# EAGLE schematic robo-tito2 (EAGLE 7.3.0)
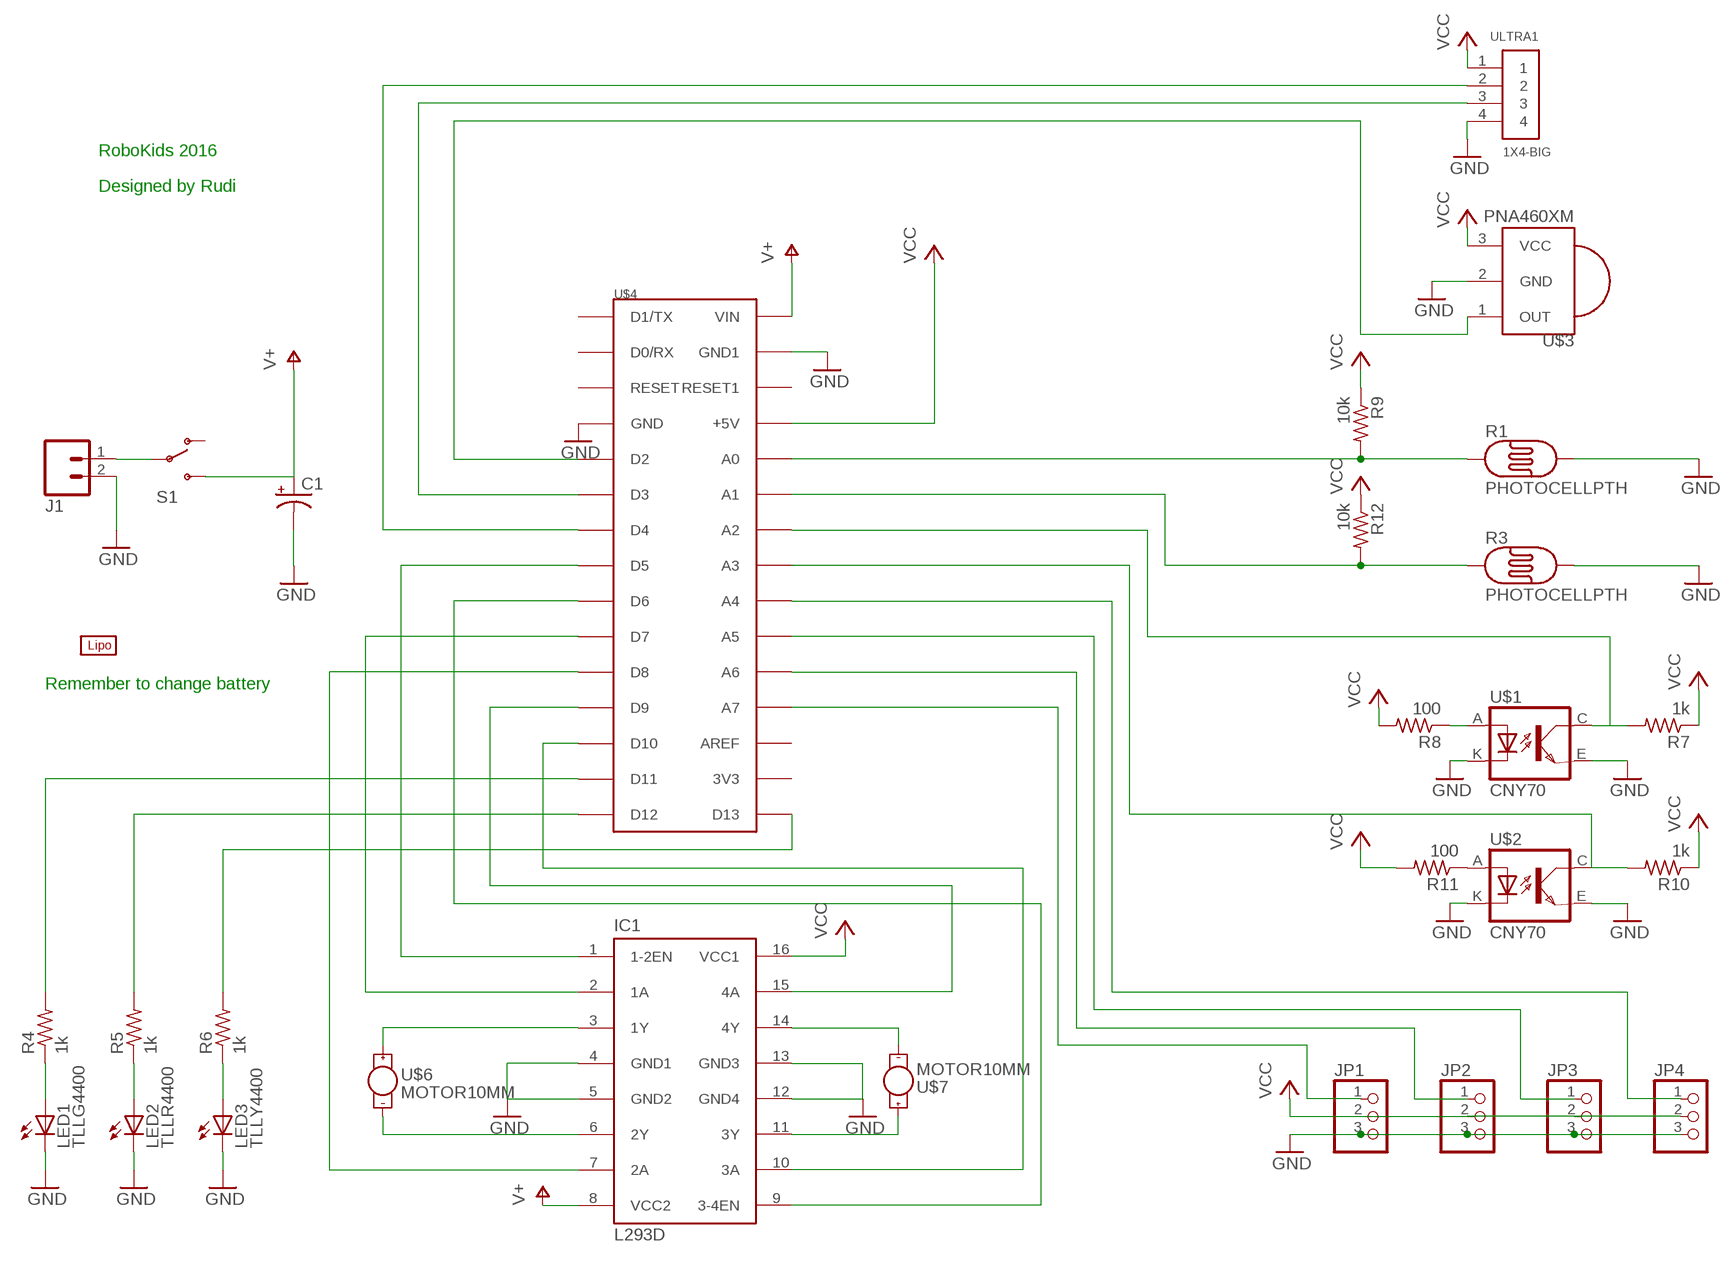
[diagram p0: schematic, sheet 1]

## Parts
C1  CPOL-USE10-20  [EB20D]
IC1  L293D  [DIL16]
J1  M02-JST-2-PTH-NO_SILK  [JST-2-PTH-NS]
JP1  PINHD-1X3  [1X03]
JP2  PINHD-1X3  [1X03]
JP3  PINHD-1X3  [1X03]
JP4  PINHD-1X3  [1X03]
LED1  TLLG4400  [LED3MM]
LED2  TLLR4400  [LED3MM]
LED3  TLLY4400  [LED3MM]
R1  PHOTOCELLPTH  [PHOTOCELL]
R3  PHOTOCELLPTH  [PHOTOCELL]
R4  1k  R-US_0207/12  [0207/12]
R5  1k  R-US_0207/12  [0207/12]
R6  1k  R-US_0207/12  [0207/12]
R7  1k  R-US_0207/12  [0207/12]
R8  100  R-US_0207/12  [0207/12]
R9  10k  R-US_0207/12  [0207/12]
R10  1k  R-US_0207/12  [0207/12]
R11  100  R-US_0207/12  [0207/12]
R12  10k  R-US_0207/12  [0207/12]
S1  SWITCH-SPDTPTH2  [SWITCHE-DPDT]
U$1  CNY70  [4]
U$2  CNY70  [4]
U$3  PNA460XM  [PNA460XM]
U$4  ARDUINONANO  [PDIP-32]
U$5  LIPO-OUTLINE2000  [LIPO-2000]
U$6  MOTOR10MM  [VIBE-MOTOR-10MM]
U$7  MOTOR10MM  [VIBE-MOTOR-10MM]
ULTRA1  1X4-BIG  [1X04-BIG]

## Nets
GND: C1.- IC1.4(GND1) IC1.5(GND2) IC1.12(GND4) IC1.13(GND3) J1.2 JP1.3 JP2.3 JP3.3 JP4.3 LED1.K(C) LED2.K(C) LED3.K(C) R1.2 R3.2 U$1.E(EMI) U$1.K(C) U$2.E(EMI) U$2.K(C) U$3.2(GND) U$4.GND U$4.GND1 ULTRA1.4
N$1: LED1.A R4.1
N$2: LED2.A R5.1
N$3: LED3.A R6.1
N$4: IC1.2(1A) U$4.D7
N$5: IC1.7(2A) U$4.D8
N$6: IC1.15(4A) U$4.D9
N$7: IC1.10(3A) U$4.D10
N$8: IC1.1(1-2EN) U$4.D5
N$9: IC1.9(3-4EN) U$4.D6
N$10: IC1.3(1Y) U$6.+
N$11: IC1.6(2Y) U$6.-
N$12: IC1.14(4Y) U$7.-
N$13: IC1.11(3Y) U$7.+
N$14: R4.2 U$4.D11
N$15: R5.2 U$4.D12
N$16: R6.2 U$4.D13
N$17: U$4.A3
N$18: R7.2 U$1.C(COL) U$4.A2
N$19: R11.1 U$2.A
N$20: U$3.1(OUT) U$4.D2
N$21: J1.1 S1.2(P)
N$22: R8.1 U$1.A
N$23: JP1.1 U$4.A7
N$24: R1.1 R9.2 U$4.A0
N$25: R3.1 R12.2 U$4.A1
N$26: R10.2 U$2.C(COL)
N$27: U$4.D4 ULTRA1.2
N$28: U$4.D3 ULTRA1.3
N$29: JP2.1 U$4.A6
N$30: JP3.1 U$4.A5
N$31: JP4.1 U$4.A4
V+: C1.+ IC1.8(VCC2) S1.3(S) U$4.VIN
VCC: IC1.16(VCC1) JP1.2 JP2.2 JP3.2 JP4.2 R7.1 R8.2 R9.1 R10.1 R11.2 R12.1 U$3.3(VCC) U$4.+5V ULTRA1.1
Unconnected: S1.1(O) U$4.3V3 U$4.AREF U$4.D0/RX U$4.D1/TX U$4.RESET U$4.RESET1

## Notes on the sheet
- RoboKids 2016
- Designed by Rudi
- Remember to change battery

## Library data of the parts
C1 = adafruit:CPOL-US: POLARIZED CAPACITOR, American symbol
IC1 = st-microelectronics:L293D: PUSH-PULL 4 CHANNEL DRIVER; MPN: L293D; OC_FARNELL: 9589619; OC_NEWARK: 56P8249
J1 = SparkFun-Connectors:M02: Standard 2-pin 0.1" header. Use with - straight break away headers ( PRT-00116) - right angle break away headers (PRT-00553) - swiss pins (PRT-00743) - machine pins (PRT-00117) - female headers (PRT-00115) Molex polarized connector foot print use with: PRT-08233 with associated crimp pins and housings. 2.54_SCREWTERM for use with PRT-10571. 3.5mm Screw Terminal footprints for PRT-08084 5mm Screw Terminal footprints for use with PRT-08432
JP1-JP4 = adafruit:PINHD-1X3: PIN HEADER
LED1 = led:TLLG4400: Low Current (2mA) LED 3 mm Tinted Diffused Package color GREEN Source: Data sheet <http://www.farnell.com/datasheets/391098.pdf>; MF: VISHAY SEMICONDUCTOR; OC_FARNELL: 1612435
LED2 = led:TLLR4400: Low Current (2mA) LED 3 mm Tinted Diffused Package color RED Source: Data sheet <http://www.farnell.com/datasheets/391100.pdf>; MF: VISHAY SEMICONDUCTOR; OC_FARNELL: 1612437
LED3 = led:TLLY4400: Low Current (2mA) LED 3 mm Tinted Diffused Package color YELLOW Source: Data sheet <http://www.farnell.com/datasheets/391098.pdf>; MF: VISHAY SEMICONDUCTOR; OC_FARNELL: 1612439
R1 R3 = SparkFun-Sensors:PHOTOCELL: CdS photoresistor. This is a low cost way to detect light levels. Resistance decreases with more incoming light. SparkFun SKU: SEN-09088
R4-R12 = adafruit:R-US_: RESISTOR, American symbol
S1 = SparkFun-Electromechanical:SWITCH-SPDT: SPDT Switch Simple slide switch, Spark Fun Electronics SKU : COM-00102 DPDT SMT slide switch, AYZ0202, SWCH-08179
U$1 U$2 = cny70:CNY70
U$3 = adafruit:PNA460XM: IR 38KHz receiver PNA4602 and related receivers http://www.ladyada.net/library/pcb/eaglelibrary.html
U$4 = jet-lib:ARDUINONANO: This is a simple part to represent Arduino NANO clon.
U$5 = SparkFun-Electromechanical:LIPO-OUTLINE: Outlines for common LiPo batteries sold by SparkFun. For fit only- no pads or connectors!
U$6 U$7 = SparkFun-Electromechanical:MOTOR: Vibration Motor- ROB-08449 Physical dimension and wire connections for this powerful vibration motor. Motor has a self adhesive backing.
ULTRA1 = adafruit:1X4: 4-pin connector